# Altium schematic sheet VESC_KS75600_mos_driver_conn.SchDoc
size A3; SheetNumber: 4; SheetTotal: 4
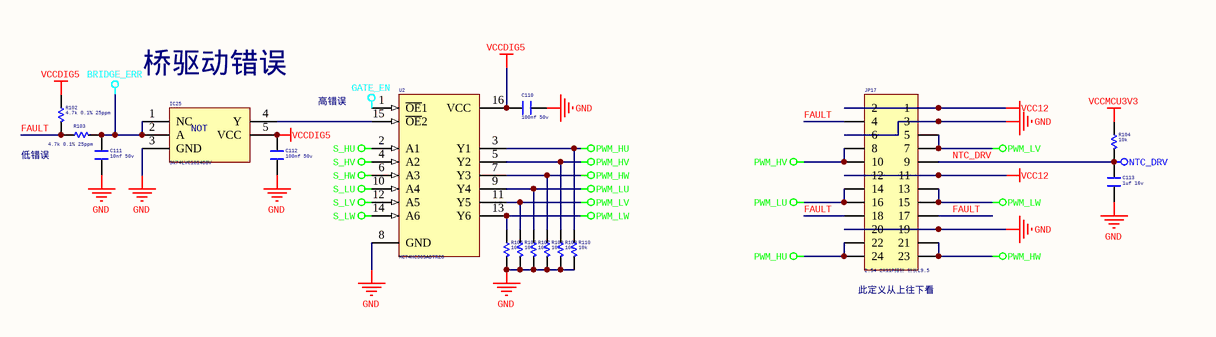
[diagram p0: VESC_KS75600_mos_driver_conn.SchDoc]

## Parts
C110  100nf 50v  [C 0603]
C111  10nf 50v  [C 0603]
C112  100nf 50v  [C 0603]
C113  1uf 16v  [C 0603]
IC25  SN74LVC1G14DBV  [SOT23-5N]
JP17  2.54 2X11P排针 针长L9.5  [HDR-12X2]
R102  4.7k 0.1% 25ppm  [R 0805]
R103  4.7k 0.1% 25ppm  [R 0805]
R104  10k  [R 0603]
R105  10k  [R 0805]
R106  10k  [R 0805]
R107  10k  [R 0805]
R108  10k  [R 0805]
R109  10k  [R 0805]
R110  10k  [R 0805]
U2  MC74HC365ADTR2G  [TSSOP16_L]

## Nets
BRIDGE_ERR: C111.1 IC25.1(NC) IC25.2(A) R103.2
GATE_EN: U2.1(~{OE}1)
GND: C110.2 C111.2 C112.1 C113.1 IC25.3(GND) JP17.3 JP17.6 JP17.19 JP17.20 R105.2 R106.2 R107.2 R108.2 R109.2 R110.2 U2.8(GND)
NTC_DRV: C113.2 JP17.9 R104.2
PWM_HU: JP17.22 JP17.24 R110.1 U2.3(Y1)
PWM_HV: JP17.8 JP17.10 R109.1 U2.5(Y2)
PWM_HW: JP17.21 JP17.23 R108.1 U2.7(Y3)
PWM_LU: JP17.14 JP17.16 R107.1 U2.9(Y4)
PWM_LV: JP17.5 JP17.7 R106.1 U2.11(Y5)
PWM_LW: JP17.13 JP17.15 R105.1 U2.13(Y6)
S_HU: U2.2(A1)
S_HV: U2.4(A2)
S_HW: U2.6(A3)
S_LU: U2.10(A4)
S_LV: U2.12(A5)
S_LW: U2.14(A6)
VCC12: JP17.1 JP17.2 JP17.11 JP17.12
VCCDIG5: C110.1 C112.2 IC25.5(VCC) R102.1 U2.16(VCC)
VCCMCU3V3: R104.1
FAULT: JP17.4 JP17.17 JP17.18 R102.2 R103.1
NetIC25_4: IC25.4(Y) U2.15(~{OE}2)

## Notes on the sheet
- (near IC25) 桥驱动错误
- 高错误
- 低错误
- (near JP17) 此定义从上往下看
- (in symbol SN74LVC1G14) NOT

## Library data of the parts
C110-C113 = C: 无极性贴片电容
  C110 C112: Voltage: 50v; Value: 100nf
  C111: Voltage: 50v; Value: 10nf
  C113: Voltage: 16v; Value: 1uf
IC25 = SN74LVC1G14: 单路施密特触发反向器
JP17 = Header 12X2: 12*2P接插件
R102-R110 = R: 贴片电阻
  R102 R103: Value: 4.7k 0.1% 25ppm
  R104-R110: Value: 10k
U2 = SN74HC365D: 6路缓冲器